# EAGLE schematic bobby (EAGLE 6.6.0)
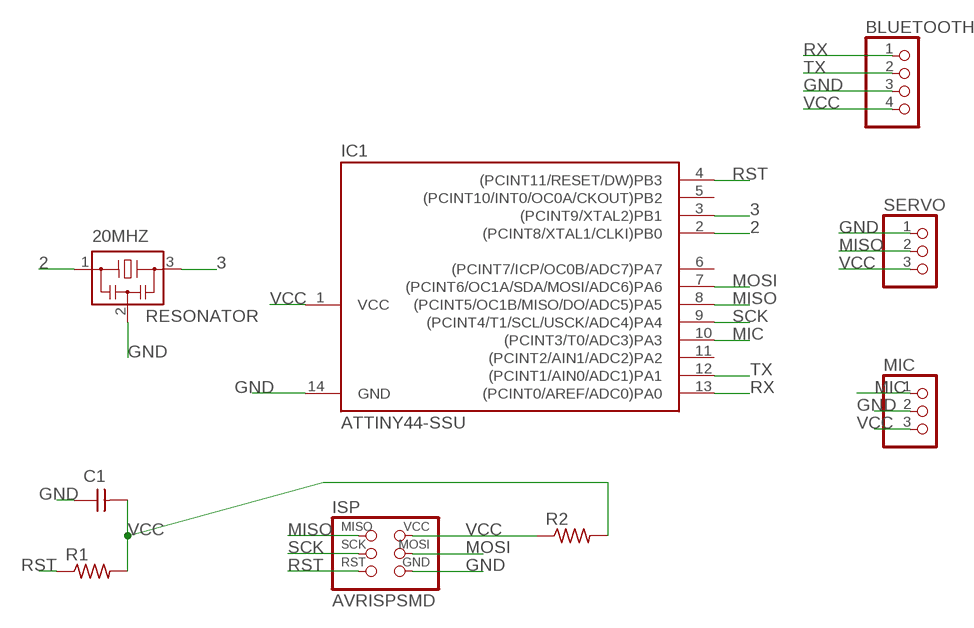
[diagram p0: schematic, sheet 1]

## Parts
20MHZ  RESONATOR  [EFOBM]
BLUETOOTH  PINHD-1X4/90  [1X04/90]
C1  CAP-UNPOLARIZEDFAB  [C1206FAB]
IC1  ATTINY44-SSU  [SOIC14]
ISP  AVRISPSMD  [2X03SMD]
MIC  PINHD-1X3/90  [1X03/90]
R1  RES-US1206FAB  [R1206FAB]
R2  RES-US1206FAB  [R1206FAB]
SERVO  PINHD-1X3/90  [1X03/90]

## Nets
2: 20MHZ.1 IC1.2((PCINT8/XTAL1/CLKI)PB0)
3: 20MHZ.3 IC1.3((PCINT9/XTAL2)PB1)
GND: 20MHZ.2 BLUETOOTH.3 C1.1 IC1.14(GND) ISP.6(GND) MIC.2 SERVO.1
MIC: IC1.10((PCINT3/T0/ADC3)PA3) MIC.1
MISO: IC1.8((PCINT5/OC1B/MISO/DO/ADC5)PA5) ISP.1(MISO) SERVO.2
MOSI: IC1.7((PCINT6/OC1A/SDA/MOSI/ADC6)PA6) ISP.4(MOSI)
RST: IC1.4((PCINT11/RESET/DW)PB3) ISP.5(RST) R1.1
RX: BLUETOOTH.1 IC1.13((PCINT0/AREF/ADC0)PA0)
SCK: IC1.9((PCINT4/T1/SCL/USCK/ADC4)PA4) ISP.3(SCK)
TX: BLUETOOTH.2 IC1.12((PCINT1/AIN0/ADC1)PA1)
VCC: BLUETOOTH.4 C1.2 IC1.1(VCC) ISP.2(VCC) MIC.3 R1.2 R2.1 R2.2 SERVO.3
Unconnected: IC1.5((PCINT10/INT0/OC0A/CKOUT)PB2) IC1.6((PCINT7/ICP/OC0B/ADC7)PA7) IC1.11((PCINT2/AIN1/ADC2)PA2)

## Library data of the parts
20MHZ = fab:RESONATOR
BLUETOOTH = pinhead:PINHD-1X4: PIN HEADER
C1 = fab:CAP-UNPOLARIZED
IC1 = fab:ATTINY44
ISP = fab:AVRISP
MIC SERVO = pinhead:PINHD-1X3: PIN HEADER
R1 R2 = fab:RES-US: Resistor (US Symbol) Variants with postfix FAB are widened to allow the routing of internal traces